# Altium schematic sheet JS7628_base_audio_v1.0.SchDoc
size A4
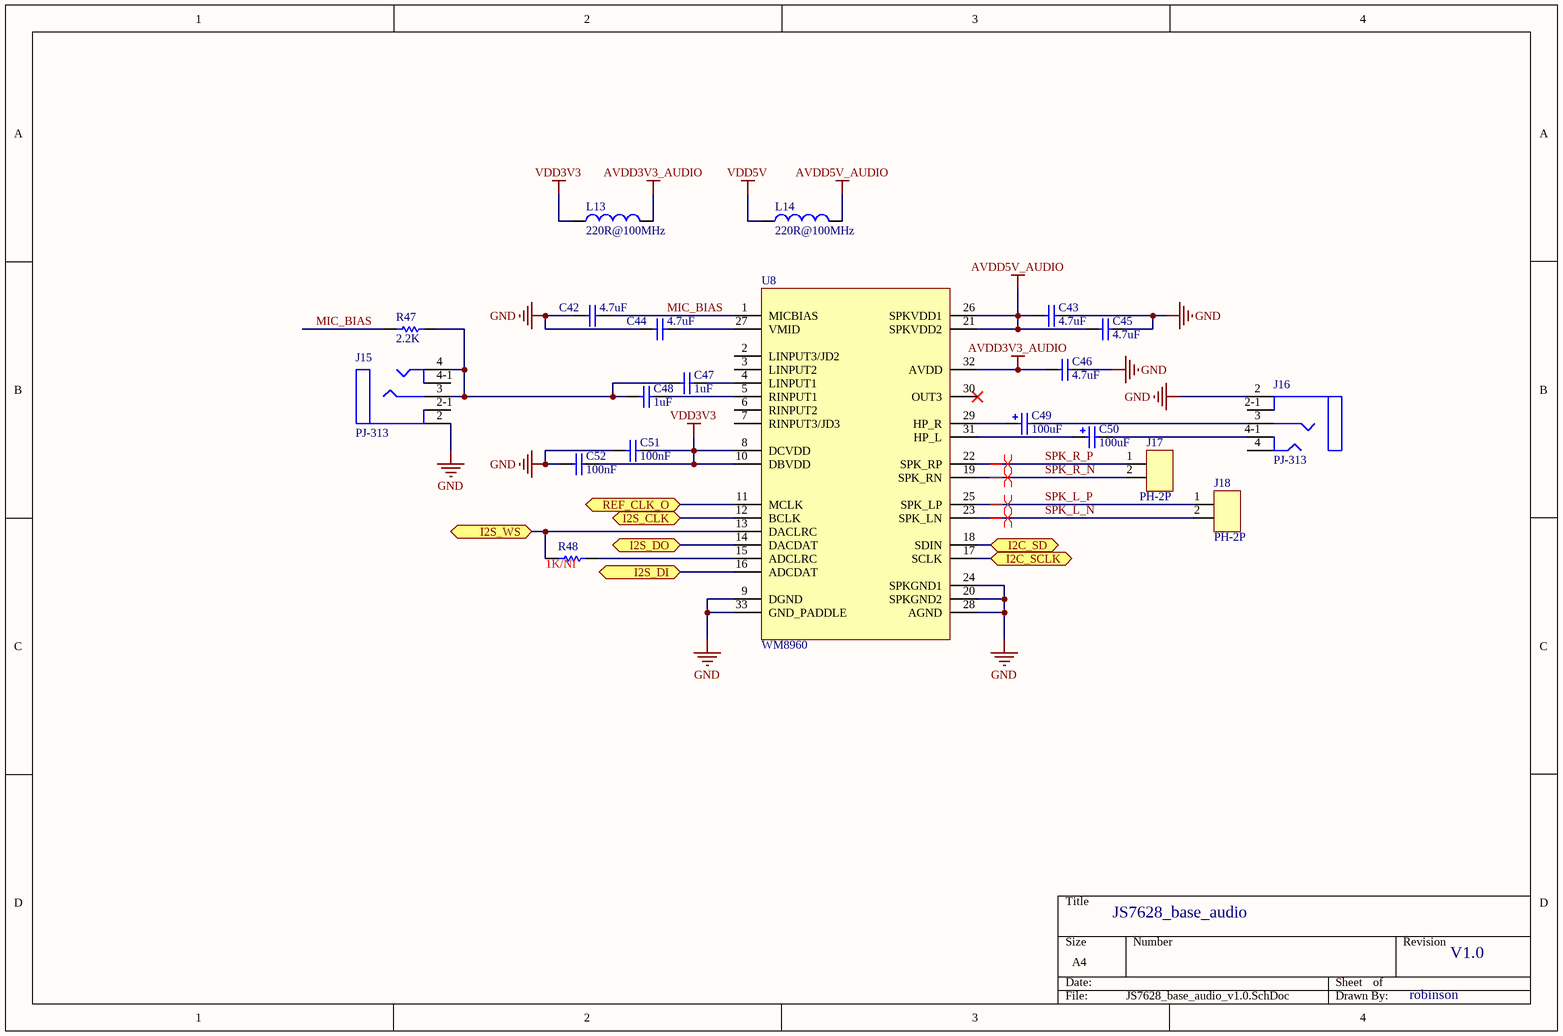
[diagram p0: JS7628_base_audio_v1.0.SchDoc]

## Parts
C42  value 4.7uF  [0603]  (hidden comment: CAP-SMT)
C43  value 4.7uF  [0603]  (hidden comment: CAP-SMT)
C44  value 4.7uF  [0603]  (hidden comment: CAP-SMT)
C45  value 4.7uF  [0603]  (hidden comment: CAP-SMT)
C46  value 4.7uF  [0603]  (hidden comment: CAP-SMT)
C47  value 1uF  [0603]  (hidden comment: CAP-SMT)
C48  value 1uF  [0603]  (hidden comment: CAP-SMT)
C49  value 100uF  [RB2.5-6.5]  (hidden comment: cap-pol)
C50  value 100uF  [RB2.5-6.5]  (hidden comment: cap-pol)
C51  value 100nF  [0603]  (hidden comment: CAP-SMT)
C52  value 100nF  [0603]  (hidden comment: CAP-SMT)
J15  PJ-313  [PJ-313]
J16  PJ-313  [PJ-313]
J17  PH-2P  [PH2.0-2P]
J18  PH-2P  [PH2.0-2P]
L13  value 220R@100MHz  [0603]  (hidden comment: inductor)
L14  value 220R@100MHz  [0603]  (hidden comment: inductor)
R47  value 2.2K  [0603]  (hidden comment: RES-SMT)
R48  value 1K/NI  [0603]  (hidden comment: RES-SMT)
U8  WM8960  [QFN-32]

## Ports
I2C_SCLK, I2C_SD, I2S_CLK, I2S_DI, I2S_DO, I2S_WS, REF_CLK_O

## Nets
AVDD3V3_AUDIO: C46.1 L13.2 U8.32(AVDD)
AVDD5V_AUDIO: C43.2 C45.2 L14.2 U8.21(SPKVDD2) U8.26(SPKVDD1)
GND: C42.2 C43.1 C44.2 C45.1 C46.2 C51.1 C52.1 J15.2(GND) J16.2(GND) U8.9(DGND) U8.20(SPKGND2) U8.24(SPKGND1) U8.28(AGND) U8.33(GND_PADDLE)
VDD3V3: C51.2 C52.2 L13.1 U8.8(DCVDD) U8.10(DBVDD)
VDD5V: L14.1
I2C_SCLK: U8.17(SCLK) ; port I2C_SCLK
I2C_SD: U8.18(SDIN) ; port I2C_SD
I2S_CLK: U8.12(BCLK) ; port I2S_CLK
I2S_DI: U8.16(ADCDAT) ; port I2S_DI
I2S_DO: U8.14(DACDAT) ; port I2S_DO
I2S_WS: R48.1 U8.13(DACLRC) ; port I2S_WS
MIC_BIAS: C42.1 R47.1 U8.1(MICBIAS)
REF_CLK_O: U8.11(MCLK) ; port REF_CLK_O
SPK_L_N: J18.2 U8.23(SPK_LN)
SPK_L_P: J18.1 U8.25(SPK_LP)
SPK_R_N: J17.2 U8.19(SPK_RN)
SPK_R_P: J17.1 U8.22(SPK_RP)
NetC44_1: C44.1 U8.27(VMID)
NetC47_1: C47.1 C48.1 J15.3 J15.4 R47.2
NetC47_2: C47.2 U8.4(LINPUT1)
NetC48_2: C48.2 U8.5(RINPUT1)
NetC49_1: C49.1 U8.29(HP_R)
NetC49_2: C49.2 J16.3
NetC50_1: C50.1 U8.31(HP_L)
NetC50_2: C50.2 J16.4-1
NetR48_2: R48.2 U8.15(ADCLRC)

Not connected (* = marked no-connect by the designer): J15 2-1 4-1; J16 2-1 4; U8 2(LINPUT3/JD2) 3(LINPUT2) 6(RINPUT2) 7(RINPUT3/JD3) 30(OUT3)*

## Layout directives
differential pair: SPK_L_N, SPK_L_P, SPK_R_N, SPK_R_P

## Notes on the sheet
- JS7628_base_audio
- V1.0
- robinson